# Altium schematic sheet THS788_3.SchDoc: FIT_PM12 board
size 420 x 297 mm; CheckedBy: G.Kasprowicz; Author: INR Moscow; CompanyName: WUT ISE; DrawnBy: M.Podgórski; Organization: WUT ISE; Address1: PW ISE; Address2: Nowowiejska 15/19 00-665 Warsaw; Address3: gkasprow@gmail.com; DocumentNumber: 24; Revision: 2; SheetNumber: 31; SheetTotal: 34; ModifiedBy: -; CheckedDate: -; Title2: TDC3; DivGrp: WUT ISE; Designer: INR RAS; ModifiedDate: -; ProjectName: Sensor Box
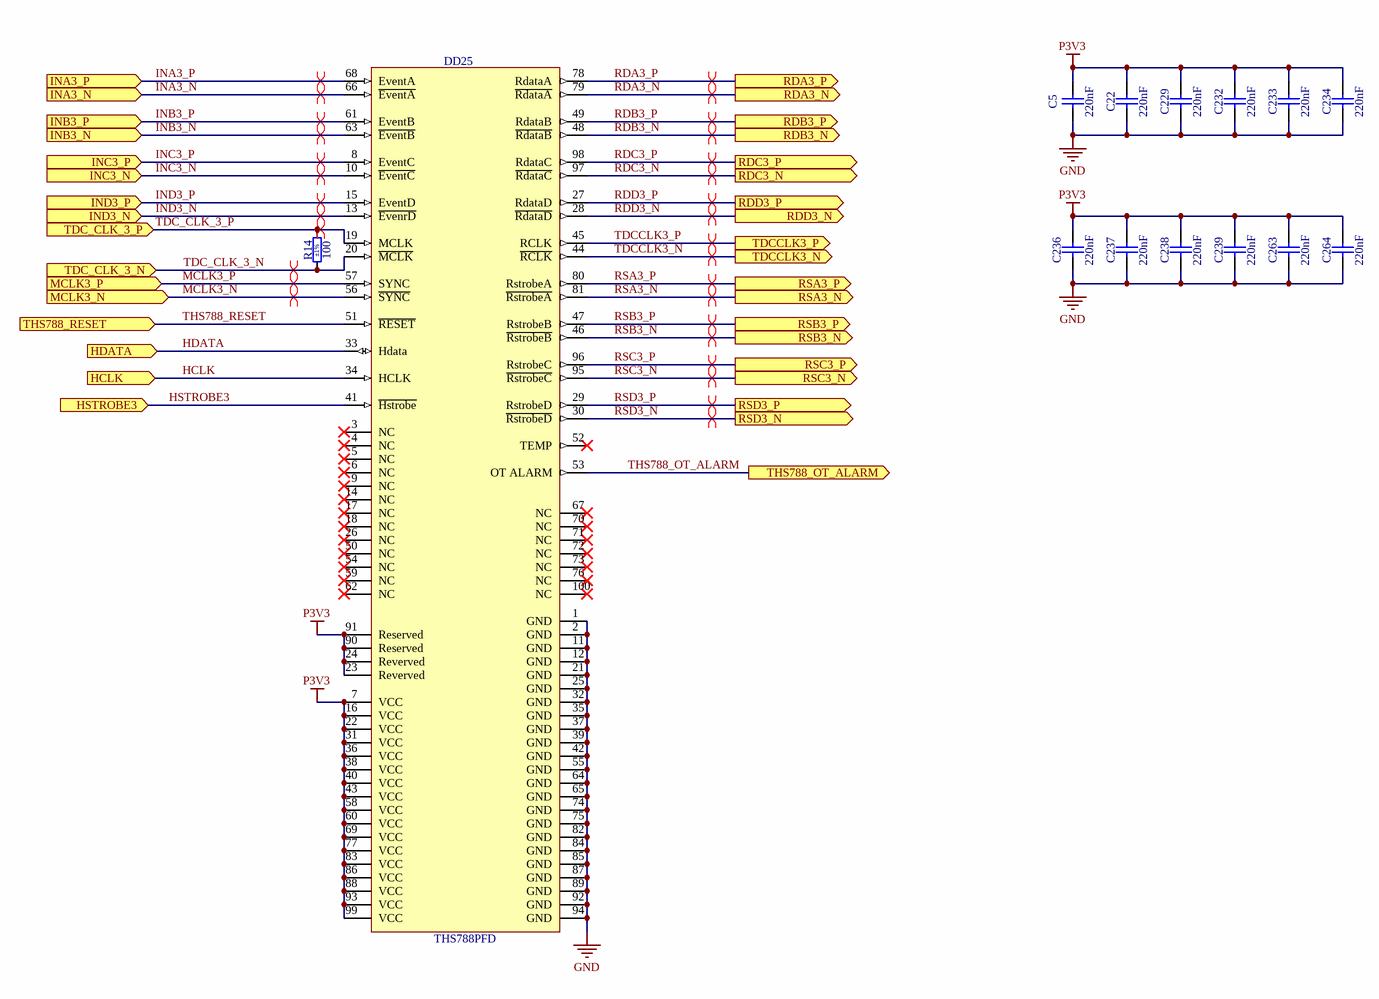
[diagram p0: THS788_3.SchDoc]

## Parts
C5  220nF  [CAPC2012X135N]
C22  220nF  [CAPC2012X135N]
C229  220nF  [CAPC2012X135N]
C232  220nF  [CAPC2012X135N]
C233  220nF  [CAPC2012X135N]
C234  220nF  [CAPC2012X135N]
C236  220nF  [CAPC2012X135N]
C237  220nF  [CAPC2012X135N]
C238  220nF  [CAPC2012X135N]
C239  220nF  [CAPC2012X135N]
C263  220nF  [CAPC2012X135N]
C264  220nF  [CAPC2012X135N]
DD25  THS788PFD  [TEXAS_PFD (S-PQFP-G100)]
R14  100  Tolerance: ±1%  [RESC1608X55N]

## Ports
HCLK (in), HDATA (in), HSTROBE3 (in), INA3_N (in), INA3_P (in), INB3_N (in), INB3_P (in), INC3_N (in), INC3_P (in), IND3_N (in), IND3_P (in), MCLK3_N (in), MCLK3_P (in), RDA3_N (out), RDA3_P (out), RDB3_N (out), RDB3_P (out), RDC3_N (out), RDC3_P (out), RDD3_N (out), RDD3_P (out), RSA3_N (out), RSA3_P (out), RSB3_N (out), RSB3_P (out), RSC3_N (out), RSC3_P (out), RSD3_N (out), RSD3_P (out), TDC_CLK_3_N (in), TDC_CLK_3_P (in), TDCCLK3_N (out), TDCCLK3_P (out), THS788_OT_ALARM (out), THS788_RESET (in)

## Nets
GND: C5.1 C22.1 C229.1 C232.1 C233.1 C234.1 C236.1 C237.1 C238.1 C239.1 C263.1 C264.1 DD25.1(GND) DD25.2(GND) DD25.11(GND) DD25.12(GND) DD25.21(GND) DD25.25(GND) DD25.32(GND) DD25.35(GND) DD25.37(GND) DD25.39(GND) DD25.42(GND) DD25.55(GND) DD25.64(GND) DD25.65(GND) DD25.74(GND) DD25.75(GND) DD25.82(GND) DD25.84(GND) DD25.85(GND) DD25.87(GND) DD25.89(GND) DD25.92(GND) DD25.94(GND)
P3V3: C5.2 C22.2 C229.2 C232.2 C233.2 C234.2 C236.2 C237.2 C238.2 C239.2 C263.2 C264.2 DD25.7(VCC) DD25.16(VCC) DD25.22(VCC) DD25.23(Reverved) DD25.24(Reverved) DD25.31(VCC) DD25.36(VCC) DD25.38(VCC) DD25.40(VCC) DD25.43(VCC) DD25.58(VCC) DD25.60(VCC) DD25.69(VCC) DD25.77(VCC) DD25.83(VCC) DD25.86(VCC) DD25.88(VCC) DD25.90(Reserved) DD25.91(Reserved) DD25.93(VCC) DD25.99(VCC)
HCLK: DD25.34(HCLK) ; port HCLK
HDATA: DD25.33(Hdata) ; port HDATA
HSTROBE3: DD25.41(~{Hstrobe}) ; port HSTROBE3
INA3_N: DD25.66(~{EventA}) ; port INA3_N
INA3_P: DD25.68(EventA) ; port INA3_P
INB3_N: DD25.63(~{EventB}) ; port INB3_N
INB3_P: DD25.61(EventB) ; port INB3_P
INC3_N: DD25.10(~{EventC}) ; port INC3_N
INC3_P: DD25.8(EventC) ; port INC3_P
IND3_N: DD25.13(~{EvenrD}) ; port IND3_N
IND3_P: DD25.15(EventD) ; port IND3_P
MCLK3_N: DD25.56(~{SYNC}) ; port MCLK3_N
MCLK3_P: DD25.57(SYNC) ; port MCLK3_P
RDA3_N: DD25.79(~{RdataA}) ; port RDA3_N
RDA3_P: DD25.78(RdataA) ; port RDA3_P
RDB3_N: DD25.48(~{RdataB}) ; port RDB3_N
RDB3_P: DD25.49(RdataB) ; port RDB3_P
RDC3_N: DD25.97(~{RdataC}) ; port RDC3_N
RDC3_P: DD25.98(RdataC) ; port RDC3_P
RDD3_N: DD25.28(~{RdataD}) ; port RDD3_N
RDD3_P: DD25.27(RdataD) ; port RDD3_P
RSA3_N: DD25.81(~{RstrobeA}) ; port RSA3_N
RSA3_P: DD25.80(RstrobeA) ; port RSA3_P
RSB3_N: DD25.46(~{RstrobeB}) ; port RSB3_N
RSB3_P: DD25.47(RstrobeB) ; port RSB3_P
RSC3_N: DD25.95(~{RstrobeC}) ; port RSC3_N
RSC3_P: DD25.96(RstrobeC) ; port RSC3_P
RSD3_N: DD25.30(~{RstrobeD}) ; port RSD3_N
RSD3_P: DD25.29(RstrobeD) ; port RSD3_P
TDC_CLK_3_N: DD25.20(~{MCLK}) R14.1 ; port TDC_CLK_3_N
TDC_CLK_3_P: DD25.19(MCLK) R14.2 ; port TDC_CLK_3_P
TDCCLK3_N: DD25.44(~{RCLK}) ; port TDCCLK3_N
TDCCLK3_P: DD25.45(RCLK) ; port TDCCLK3_P
THS788_OT_ALARM: DD25.53(OT_ALARM) ; port THS788_OT_ALARM
THS788_RESET: DD25.51(~{RESET}) ; port THS788_RESET

Not connected (* = marked no-connect by the designer): DD25 3(NC)* 4(NC)* 5(NC)* 6(NC)* 9(NC)* 14(NC)* 17(NC)* 18(NC)* 26(NC)* 50(NC)* 52(TEMP)* 54(NC)* 59(NC)* 62(NC)* 67(NC)* 70(NC)* 71(NC)* 72(NC)* 73(NC)* 76(NC)* 100(NC)*

## Layout directives
differential pair: INA3_N, INA3_P, INB3_N, INB3_P, INC3_N, INC3_P, IND3_N, IND3_P, MCLK3_N, MCLK3_P, RDA3_N, RDA3_P, RDB3_N, RDB3_P, RDC3_N, RDC3_P, RDD3_N, RDD3_P, RSA3_N, RSA3_P, RSB3_N, RSB3_P, RSC3_N, RSC3_P, RSD3_N, RSD3_P, TDC_CLK_3_N, TDC_CLK_3_P, TDCCLK3_N, TDCCLK3_P

## Notes on the sheet
- Project/Equipment
- Document
- Designer
- Drawn by
- Check.by
- Copyright WUT ISE 2024.
  This documentation describes Open Hardware and is licensed under the CERN OHL v.2. You may redistribute and modify this documentation under the terms of the CERN OHL v.2. (http://ohwr.org/CERNOHL). This documentation is distributed WITHOUT ANY EXPRESS OR IMPLIED WARRANTY, INCLUDING OF MERCHANTABILITY, SATISFACTORY QUALITY AND FITNESS FOR A PARTICULAR PURPOSE. Please see the CERN OHL v.2 for applicable conditions.
- Contact
- File
- Last Mod.
- Print Date
- Sheet
- Size
- A3
- of
- Rev

## Library data of the parts
C5 C22 C229 C232-C234 C236-C239 C263 C264 = CC0805_220NF_50V_10%_X7R: Non-polarised capacitor; Part Description: SMD Multilayer Chip Ceramic Capacitor; Manufacturer: GENERIC; Manufacturer1 Part Number: GRM21BR71H224KA01L; Voltage: 50V; TC: X7R; Tolerance: ±10%; Part Number: CC0805_220NF_50V_10%_X7R; Component Kind: Standard; Component Type: Standard; Pin Count: 2; Value: 220nF; Status: Preferred; Manufacturer Part Number: CC0805_220NF_50V_10%_X7R; Case: 0805; Mounted: Yes; Socket: No; SMD: Yes; Sense: No; Manufacturer1 Example: MURATA; Manufacturer1 ComponentHeight: 1.35mm; HelpURL: \\cern.ch\dfs\Applications\Altium\Datasheets\CC0805_X7R_MURATA.pdf; Author: CERN DEM JLC; CreateDate: 03.12.2007; LatestRevisionDate: 03.12.2007
DD25 = THS788PFD: Quad-Channel Time Measurement Unit (TMU); Manufacturer: TEXAS INSTRUMENTS; PressFit: No; Bonding: No; Part Number: THS788PFD; Component Kind: Standard; Component Type: Standard; Device: THS788PFD; Footprint: TEXAS_3PFD (S-PQFP-G100); PackageDescription: QFP, 0.50mm Pitch, Square; 100 Pin, 14.0mm L X 14.0mm W X 1.20mm H body (w/Thermal Tab 6.0 X 6.0mm), IPC Medium Density; Status: Not Recommended; Part Description: Quad-Channel Time Measurement Unit (TMU); Manufacturer Part Number: THS788PFD; Pin Count: 101; Case: QFP100; Mounted: Yes; Socket: No; SMD: Yes; Sense: No; ComponentHeight: 1.2mm; Author: CERN DEM HF; HelpURL: \\cern.ch\dfs\Applications\Altium\Datasheets\THS788.pdf; CreateDate: 10.06.2024; LatestRevisionDate: 10.06.2024
R14 = R0603_100R_1%_0.1W_100PPM: Resistor - 1%; Part Description: General Purpose Thick Film Chip Resistor; Manufacturer: GENERIC; Manufacturer1 Part Number: NRC06F4700TRF; Power: 0.1W; TC: ±100ppm/°C; PressFit: No; Part Number: R0603_100R_1%_0.1W_100PPM; Component Kind: Standard; Component Type: Standard; Pin Count: 2; Value: 100; Status: Preferred; Manufacturer Part Number: R0603_100R_1%_0.1W_100PPM; Case: 0603; Mounted: Yes; Sense: No; Socket: No; SMD: Yes; Manufacturer1 Example: NIC COMPONENT; Manufacturer1 ComponentHeight: 0.55mm; HelpURL: \\cern.ch\dfs\Applications\Altium\Datasheets\R0603_3NIC_3NRC.pdf; Author: CERN DEM JLC; CreateDate: 03.12.2007; LatestRevisionDate: 13.03.2008